# Altium project 3D_Scanner_PCB.PrjPcb
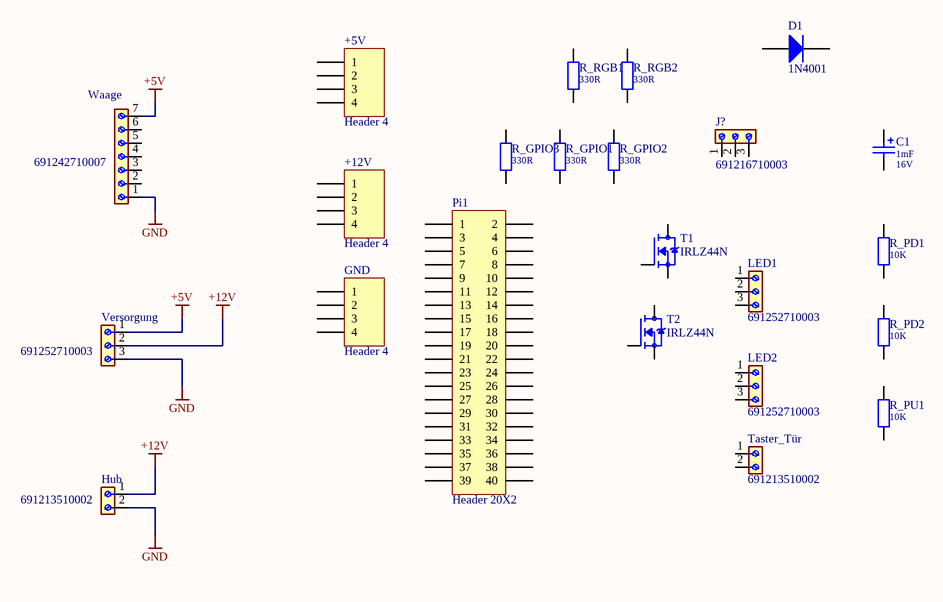
[diagram p0: PCB_Schematic.SchDoc]
1 sheet, 23 parts. Net scope: global (net labels, ports and power ports of the same name join across sheets).
Board file: 3D_Scanner_PCB.PcbDoc

## Sheet PCB_Schematic.SchDoc
size A4; SheetNumber: 1; SheetTotal: 1; SPICEModelCacheZUWSFTOK: <root> / <DocumentId>ZUWSFTOK</DocumentId> / <CacheFrame Number="0"> / <Model Name="di_1n4001" Kind="MDL"> / <Text>*************************************************************************************************************************************** / *SRC=1N4001;DI_1N4001;Diodes;Si;  50.0V  1.00A  3.00us   Diodes, Inc. diode / .MODEL DI_1N4001 D  ( IS=76.9p RS=42.0m BV=50.0 IBV=5.00u / + CJO=39.8p  M=0.333 N=1.45 TT=4.32u )</Text> / </Model> / </CacheFrame> / </root>

### Parts
+5V  Header 4  [HDR1X4]
+12V  Header 4  [HDR1X4]
C1  Rated Voltage: 16V  [C_POL_RM2-8,5]  (hidden comment: 1mF)
D1  1N4001  [D_DO41-RM4]
GND  Header 4  [HDR1X4]
Hub  691213510002  [691213510002]
J?  691216710003  [691216710003]
LED1  691252710003  [691252710003]
LED2  691252710003  [691252710003]
Pi1  Header 20X2  [HDR2X20]
R_GPIO1  330R  [R_0207/RM4]
R_GPIO2  330R  [R_0207/RM4]
R_GPIO3  330R  [R_0207/RM4]
R_PD1  10K  [R_0207/RM4]
R_PD2  10K  [R_0207/RM4]
R_PU1  10K  [R_0207/RM4]
R_RGB1  330R  [R_0207/RM4]
R_RGB2  330R  [R_0207/RM4]
T1  IRLZ44N  [TO254P1054X469X1930-3]
T2  IRLZ44N  [TO254P1054X469X1930-3]
Taster_Tür  691213510002  [691213510002]
Versorgung  691252710003  [691252710003]
Waage  691242710007  [691242710007]

### Nets
+5V: Versorgung.1(+5V) Waage.7
+12V: Hub.1(+5V) Versorgung.2(+12V)
GND: Hub.2(GND) Versorgung.3(GND) Waage.1

Not connected (* = marked no-connect by the designer): +5V 1 2 3 4; +12V 1 2 3 4; C1 1(+) 2(-); D1 A C(K); GND 1 2 3 4; J? 1 2 3; LED1 1 2 3; LED2 1 2 3; Pi1 1 2 3 4 5 6 7 8 9 10 11 12 13 14 15 16 17 18 19 20 21 22 23 24 25 26 27 28 29 30 31 32 33 34 35 36 37 38 39 40; R_GPIO1 1 2; R_GPIO2 1 2; R_GPIO3 1 2; R_PD1 1 2; R_PD2 1 2; R_PU1 1 2; R_RGB1 1 2; R_RGB2 1 2; T1 1(G) 2(D) 3(S); T2 1(G) 2(D) 3(S); Taster_Tür 1 2; Waage 2 3 4 5 6

### Notes on the sheet
- Project:
- Title:
- Leitner AG
- Zona Artigianale Est 7
- 39040 Racines BZ
- Italy
- Confidential
- Author:
- Document name:
- Date:
- Version:
- Size:
- A4

### Library data of the parts
+5V +12V GND = Header 4: Header, 4-Pin; LatestRevisionDate: 17-Jul-2002; LatestRevisionNote: Re-released for DXP Platform.; Publisher: Altium Limited
C1 = C_POL: Polarized Capacitor; Usage: only permitted for non-commercial purposes at HTL I Innsbruck; Published: 21-Feb-2011; LatestRevisionDate: 07-Sep-2019; Value: 1mF
D1 = 1N4001: Si-Diode; 50V, 1.00A, 3.00us (Diodes, Inc.); Usage: only permitted for non-commercial purposes at HTL I Innsbruck; SimulationModellSource: Diodes Incorporated; Published: 21-Feb-2011; LatestRevisionDate: 01-Nov-2012
Hub Taster_Tür = 691213510002: 2 Position Wire to Board Terminal Block Horizontal with Board 0.200 (5.08mm) Through Hole; MF: WÃ¼rth Elektronik; SnapEDA_Link: https://www.snapeda.com/parts/691213510002/W%25C3%25BCrth+Elektronik+Midcom/view-part/?ref=snap; Package: None; Value: *; MP: 691213510002; Check_prices: https://www.snapeda.com/parts/691213510002/W%25C3%25BCrth+Elektronik+Midcom/view-part/?ref=eda
J? = 691216710003: 5.00 MM TERMINAL BLOCK;; MF: WÃ¼rth Elektronik; SnapEDA_Link: https://www.snapeda.com/parts/691216710003/W%25C3%25BCrth+Elektronik+Midcom/view-part/?ref=snap; Package: None; Value: *; MP: 691216710003; Check_prices: https://www.snapeda.com/parts/691216710003/W%25C3%25BCrth+Elektronik+Midcom/view-part/?ref=eda
LED1 LED2 Versorgung = 691252710003: 5.00 MM TERMINAL BLOCK;; MF: WÃ¼rth Elektronik; SnapEDA_Link: https://www.snapeda.com/parts/691252710003/W%25C3%25BCrth+Elektronik+Midcom/view-part/?ref=snap; Package: None; Value: *; MP: 691252710003; Check_prices: https://www.snapeda.com/parts/691252710003/W%25C3%25BCrth+Elektronik+Midcom/view-part/?ref=eda
Pi1 = Header 20X2: Header, 20-Pin, Dual row; LatestRevisionDate: 17-Jul-2002; LatestRevisionNote: Re-released for DXP Platform.; Publisher: Altium Limited
R_GPIO1-R_GPIO3 R_PD1 R_PD2 R_PU1 R_RGB1 R_RGB2 = R: Resistor; Usage: only permitted for non-commercial purposes at HTL I Innsbruck; Published: 21-Feb-2011; LatestRevisionDate: 07-Sep-2019
  R_GPIO1-R_GPIO3 R_RGB1 R_RGB2: Value: 330R
  R_PD1 R_PD2 R_PU1: Value: 10K
T1 T2 = IRLZ44N: N-Channel 55 V 47A (Tc) 3.8W (Ta), 110W (Tc) Surface Mount D2PAK; MF: Infineon / IR; Package: TO-220-3 Infineon / IR; Availability: Not in stock; Value: *; MP: IRLZ44N; Check_prices: https://www.snapeda.com/parts/IRLZ44N/Infineon/view-part/?ref=eda; Price: None; SnapEDA_Link: https://www.snapeda.com/parts/IRLZ44N/Infineon/view-part/?ref=snap
Waage = 691242710007: 7 Position Wire to Board Terminal Block Horizontal with Board 0.197 (5.00mm) Through Hole; MF: WÃ¼rth Elektronik; SnapEDA_Link: https://www.snapeda.com/parts/691242710007/W%25C3%25BCrth+Elektronik+Midcom/view-part/?ref=snap; Package: None; Value: *; MP: 691242710007; Check_prices: https://www.snapeda.com/parts/691242710007/W%25C3%25BCrth+Elektronik+Midcom/view-part/?ref=eda